# EAGLE schematic Blinky Schematic (EAGLE 8.4.0)
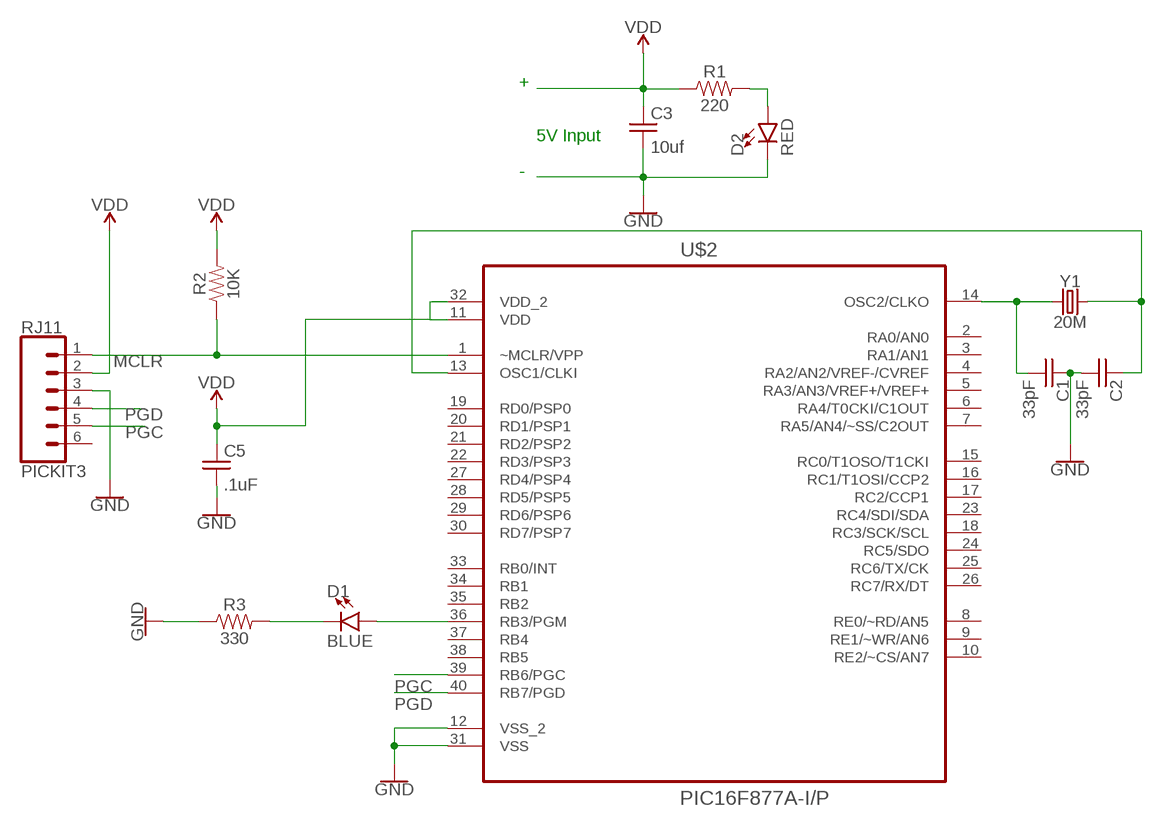
[diagram p0: schematic, sheet 1]

## Parts
C1  33pF  CAP_22UF_50VCAP_22UF_50V  [CAP_BULK]
C2  33pF  CAP_22UF_50VCAP_22UF_50V  [CAP_BULK]
C3  10uf  CAP_22UF_50VCAP_22UF_50V  [CAP_BULK]
C5  .1uF  CAP_22UF_50VCAP_22UF_50V  [CAP_BULK]
D1  BLUE  LED-BLUE0603  [LED-0603]
D2  RED  LED-RED0603  [LED-0603]
PICKIT3  RJ11  RJ11-6  [RJ11-6]
R1  220  1.2MOHM-0603-1/10W-1%  [0603]
R2  10K  1.2MOHM-0603-1/10W-1%  [0603]
R3  330  1.2MOHM-0603-1/10W-1%  [0603]
U$2  PIC16F877A-I/P  [DIP254P1524X483-40]
Y1  20M  CRYSTALPTH-2X6  [CRYSTAL-PTH-2X6-CYL]

## Nets
GND: C1.A(+) C2.B(-) C3.B(-) C5.B(-) D2.C PICKIT3.3 R3.1 U$2.12(VSS_2) U$2.31(VSS)
MCLR: PICKIT3.1 R2.1 U$2.1(~MCLR/VPP)
N$1: C1.B(-) U$2.14(OSC2/CLKO) Y1.1
N$2: C2.A(+) U$2.13(OSC1/CLKI) Y1.2
N$3: D1.C R3.2
N$4: D1.A U$2.36(RB3/PGM)
N$6: D2.A R1.2
PGC: PICKIT3.5 U$2.39(RB6/PGC)
PGD: PICKIT3.4 U$2.40(RB7/PGD)
VDD: C3.A(+) C5.A(+) PICKIT3.2 R1.1 R2.2 U$2.11(VDD) U$2.32(VDD_2)
Unconnected: PICKIT3.6 U$2.2(RA0/AN0) U$2.3(RA1/AN1) U$2.4(RA2/AN2/VREF-/CVREF) U$2.5(RA3/AN3/VREF+/VREF+) U$2.6(RA4/T0CKI/C1OUT) U$2.7(RA5/AN4/~SS/C2OUT) U$2.8(RE0/~RD/AN5) U$2.9(RE1/~WR/AN6) U$2.10(RE2/~CS/AN7) U$2.15(RC0/T1OSO/T1CKI) U$2.16(RC1/T1OSI/CCP2) U$2.17(RC2/CCP1) U$2.18(RC3/SCK/SCL) U$2.19(RD0/PSP0) U$2.20(RD1/PSP1) U$2.21(RD2/PSP2) U$2.22(RD3/PSP3) U$2.23(RC4/SDI/SDA) U$2.24(RC5/SDO) U$2.25(RC6/TX/CK) U$2.26(RC7/RX/DT) U$2.27(RD4/PSP4) U$2.28(RD5/PSP5) U$2.29(RD6/PSP6) U$2.30(RD7/PSP7) U$2.33(RB0/INT) U$2.34(RB1) U$2.35(RB2) U$2.37(RB4) U$2.38(RB5)

## Notes on the sheet
- +
- 5V Input
- -

## Library data of the parts
C1-C3 C5 = FSAE Electric:CAP_22UF_50V; PARTNO: EEE-FK1H220P; VALUE: 22uF
D1 = SparkFun-LED:LED-BLUE: Blue SMD LED Used in manufacturing of various products at SparkFun Packages: 0603 - SMD 0603 package [Product Link] <http://www.digikey.com/product-detail/en/SMLE12BC7TT86/511-1589-2-ND/1641808> 1206 - SMD1206 package [Product Link] <http://www.digikey.com/product-detail/en/lite-on-inc/LTST-C150TBKT/160-1643-1-ND/573584> SparkFun Products: ESP8266 Thing-Dev Board <https://www.sparkfun.com/products/13711> RedBoard <https://www.sparkfun.com/products/12757>; PROD_ID: DIO-08575
D2 = SparkFun-LED:LED-RED: Red SMD LED Used in manufacturing of most products at SparkFun Packages: 0603 - SMD 0603 package [Product Link] <http://docs.avagotech.com/docs/AV02-0551EN> 0603 SMART - SMD 0603 SMART package ( more efficient and expensive)[Product Link] <http://www.osram-os.com/Graphics/XPic2/00077099_0.pdf> 1206 - SMD1206 package [Product Link] <https://www.sparkfun.com/datasheets/DevTools/LilyPad/Q150OVS4.pdff> SparkFun Products: Pro Mini 328 -5V <https://www.sparkfun.com/products/821> RedBoard <https://www.sparkfun.com/products/12757> IOIO-OTG <https://www.sparkfun.com/products/13613>; PROD_ID: DIO-00819
PICKIT3 = SparkFun-Connectors:RJ11-6: RJ11 Jack - 6 pin Commonly found on CAT3 devices and some Microchip programmers. Here is the connector we sell at SparkFun: RJ11 6-Pin Connector <https://www.sparkfun.com/products/132> (PRT-00132) Datasheet <http://www.sparkfun.com/datasheets/Prototyping/Connectors/RJ11-Datasheet.pdf> It is used on this SparkFun product: SparkFun Weather Shield <https://www.sparkfun.com/products/12081> (DEV-12081) Weather Meters <https://www.sparkfun.com/products/8942> (SEN-08942); PROD_ID: CONN-08590; SF_ID: PRT-00132
R1-R3 = SparkFun-Resistors:1.2MOHM: 1.2MΩ resistor A resistor is a passive two-terminal electrical component that implements electrical resistance as a circuit element. Resistors act to reduce current flow, and, at the same time, act to lower voltage levels within circuits. - Wikipedia; PROD_ID: RES-10055; VALUE: 1.2M
U$2 = Microchip_By_element14_Batch_1:PIC16F877A-I/P: 8-Bit CMOS FLASH Microcontrollers; MPN: PIC16F877A-I/P; OC_FARNELL: 9761446; OC_NEWARK: 69K7640; PACKAGE: DIP-40; SUPPLIER: Microchip
Y1 = SparkFun-Clocks:CRYSTAL: Crystals (Generic) These are passive quartz crystals, which can be used as a clock source for a microcontroller. Crystal's are two-terminal devices. They require external "load" capacitors to generate an oscillating signal.